# Altium schematic sheet 学习型红外转发器.SchDoc: 学习型红外转发器
size A4; Organization: 智能实训室产品部; Address1: 广东省深圳市; Address2: 宝安区石岩凯普达工业园; DocumentNumber: 190405; Revision: V1.0; SheetNumber: 1; SheetTotal: 2; Date: 2019-04-09; ApprovedBy: 杨青; CheckedBy: 杨青; DrawnBy: 杨青; Engineer: 李剑平; ProjectName_GTA: 江工物联网; PCB Number: GS-X-GXM01
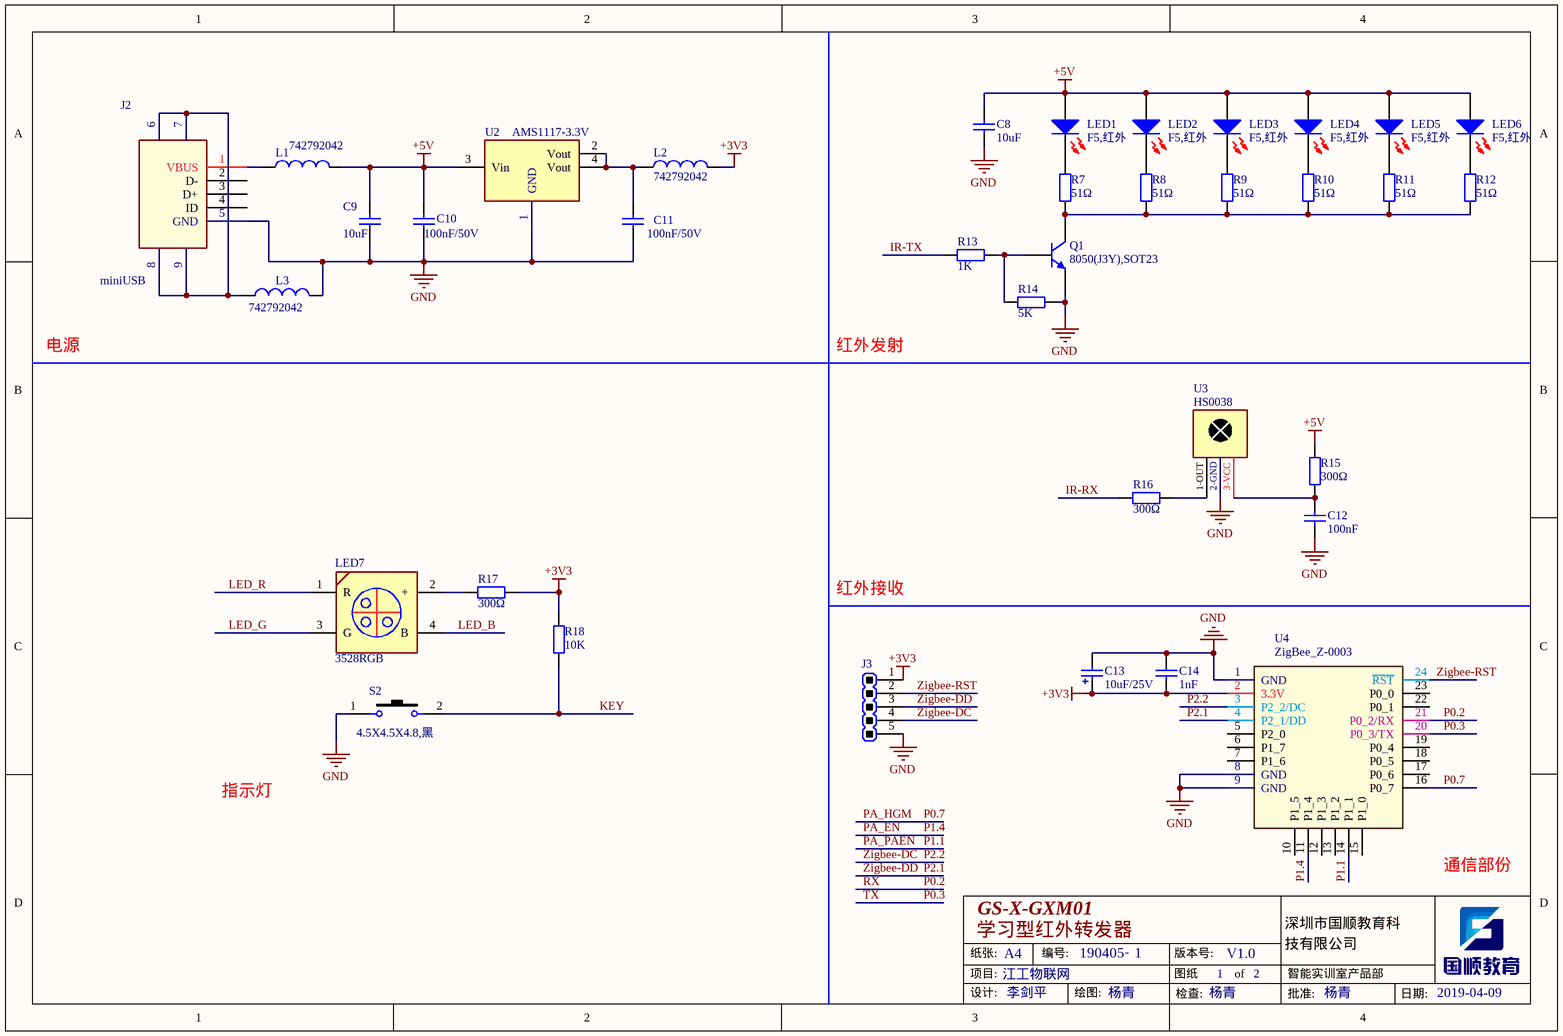
[diagram p0: 学习型红外转发器.SchDoc]

## Parts
C8  10uF  [C0603]
C9  10uF  [C0603]
C10  100nF/50V  [C0603]
C11  100nF/50V  [C0603]
C12  100nF  [C0603]
C13  10uF/25V  [TC3528X21B]
C14  1nF  [C0603]
J2  miniUSB  [USB mini/SM0.8-6H5]
J3  HDRM-1*5-2.54-AK  [HDRM-2.54-1*5P-AK1]  (value not drawn)  (no BOM)
L1  742792042  [L0805]
L2  742792042  [L0805]
L3  742792042  [L0805]
LED1  F5,红外  [IR-F5-V]
LED2  F5,红外  [IR-F5-V]
LED3  F5,红外  [IR-F5-V]
LED4  F5,红外  [IR-F5-V]
LED5  F5,红外  [IR-F5-V]
LED6  F5,红外  [IR-F5-V]
LED7  3528RGB  [LED_3528RGB]
Q1  8050(J3Y),SOT23  [SOT23]
R7  51Ω  [R0603]
R8  51Ω  [R0603]
R9  51Ω  [R0603]
R10  51Ω  [R0603]
R11  51Ω  [R0603]
R12  51Ω  [R0603]
R13  1K  [R0603]
R14  5K  [R0603]
R15  300Ω  [R0603]
R16  300Ω  [R0603]
R17  300Ω  [R0603]
R18  10K  [R0603]
S2  4.5X4.5X4.8,黑  [SW2-4.5*4.5*4.8MM-Side-BK]
U2  AMS1117-3.3V  [SOT-223]
U3  HS0038  [HS0038-H]
U4  ZigBee_Z-0003  [Module_ZigBee_Z-0003]

## Nets
+3V3: C13.1 C14.1 J3.1 L2.2 R17.1 R18.1 U4.2(3.3V)
+5V: C8.1 C9.1 C10.1 L1.2 LED1.1(A) LED2.1(A) LED3.1(A) LED4.1(A) LED5.1(A) LED6.1(A) R15.2 U2.3(Vin)
GND: C8.2 C9.2 C10.2 C11.2 C12.2 C13.2 C14.2 J2.5(GND) J3.5 L3.2 Q1.2(E) R14.2 S2.1 U2.1(GND) U3.2(GND) U4.1(GND) U4.8(GND) U4.9(GND)
IR-RX: R16.1
IR-TX: R13.1
KEY: R18.2 S2.2
LED_B: LED7.4(B)
LED_G: LED7.3(G)
LED_R: LED7.1(R)
P0.2: U4.21(P0_2/RX)  [also labelled RX]
P0.3: U4.20(P0_3/TX)  [also labelled TX]
P0.7: U4.16(P0_7)  [also labelled PA_HGM]
P1.1: U4.14(P1_1)  [also labelled PA_PAEN]
P1.4: U4.11(P1_4)  [also labelled PA_EN]
P2.1: J3.3 U4.4(P2_1/DD)  [also labelled Zigbee-DD]
P2.2: J3.4 U4.3(P2_2/DC)  [also labelled Zigbee-DC]
Zigbee-RST: J3.2 U4.24(~{RST})
NetC11_1: C11.1 L2.1 U2.2(Vout) U2.4(Vout)
NetC12_1: C12.1 R15.1 U3.3(VCC)
NetJ2_1: J2.1(VBUS) L1.1
NetJ2_6: J2.6 J2.7 J2.8 J2.9 L3.1
NetLED1_2: LED1.2(K) R7.2
NetLED2_2: LED2.2(K) R8.2
NetLED3_2: LED3.2(K) R9.2
NetLED4_2: LED4.2(K) R10.2
NetLED5_2: LED5.2(K) R11.2
NetLED6_2: LED6.2(K) R12.2
NetLED7_2: LED7.2(+) R17.2
NetQ1_1: Q1.1(B) R13.2 R14.1
NetQ1_3: Q1.3(C) R7.1 R8.1 R9.1 R10.1 R11.1 R12.1
NetR16_2: R16.2 U3.1(out)

Not connected (* = marked no-connect by the designer): J2 2(D-) 3(D+) 4(ID); U4 5(P2_0) 6(P1_7) 7(P1_6) 10(P1_5) 12(P1_3) 13(P1_2) 15(P1_0) 17(P0_6) 18(P0_5) 19(P0_4) 22(P0_1) 23(P0_0)

## Notes on the sheet
- 电源
- 红外发射
- 红外接收
- 指示灯
- (near U4) 通信部份
- 纸张:
- 项目:
- A4
- 编号:
- -
- 版本号:
- 图纸
- of
- 深圳市国顺教育科
- 技有限公司
- 设计:
- 绘图:
- 检查:
- 批准:
- 日期:
- (in symbol HS0038) 1-OUT; 2-GND; 3-VCC

## Library data of the parts
C8 C9 = 10uF_16V_0603: Capacitor; 编码: 无; 规格/型号: 10uF,16V,0603; 物料名称: 贴片电容
C10-C12 = 100nF_50V_0603: Capacitor; 编码: 无; 规格/型号: 100nF,50V,0603; 物料名称: 贴片电容
C13 = CAPC-10uF/25V_3528B: 钽电容,10uF/25V-3528B; 编码: 1010202012; 物料名称: 贴片钽电容; 规格/型号: 钽电容,10uF,25V,3528,B型
C14 = 1nF_50V_0603: Capacitor; 编码: 无; 规格/型号: 1nF,50V,0603; 物料名称: 贴片电容
J2 = USB-mini-5PF: mini-USB 5PF USB 母座; 规格/型号: mini-USB 5PF,贴片T型,USB 母座,USB-5002; 物料名称: USB接口; 单价: 0.1; 供应商: https://item.taobao.com/item.htm?id=42475441054&ali_refid=a3_420434_1006:1104662507:N:usb+mini:d1ba3785cc0cd36a97b12c38263ecbb3&ali_trackid=1_d1ba3785cc0cd36a97b12c38263ecbb3&spm=a230r.1.1957635.13
J3 = HDRM-1*5-2.54-AK: 排针,直; 规格/型号: 排针,间距2.54,1*5P,180°直插; 物料名称: 排针
L1-L3 = BEAD-742792042_0805: WE-CBF,600@100M,500Ohm,200mA,0805,742792042; 品牌: WE; 物料名称: 贴片磁珠; 规格/型号: WE-CBF,磁珠,600@100M，500Ohm,200mA,0805,742792042; 单价: 0.04
LED1-LED6 = LED-IR_F5: 红外发射; 规格/型号: F5,圆头,红外发射; 物料名称: 直插二极管
LED7 = RGB_3528: 3528,LED RGB; 规格/型号: 3528贴片LED红蓝绿三色七彩雾状灯珠,20mA; 物料名称: 贴片发光二极管; 单价: 0.125; 参数: R:2.0-2.2  G:3.0-3.2 B:3.0-3.2; 供应商: https://detail.tmall.com/item.htm?id=569373898165&ali_refid=a3_430583_1006:1110290364:N:LED%20RGB%203528:b82c81972ee6bbf0f7d8655d7a2e02d6&ali_trackid=1_b82c81972ee6bbf0f7d8655d7a2e02d6&spm=a230r.1.14.1
Q1 = NPN_8050(J3Y)_SOT23: NPN,8050,SOT23; 编码: 1010401001; 规格/型号: NPN,8050,标字J3Y,SOT23; 物料名称: 贴片三极管
R7-R12 = 51Ω_5%_0603: 51Ω,±5%,0603; 物料名称: 贴片电阻; 单价: 0.02; 规格/型号: 51Ω,±5%,0603; 参数: ±5%
R13 = 1K_5%_0603: 1K,±5%,0603; 编码: 1010101190; 物料名称: 贴片电阻; 单价: 0.02; 规格/型号: 1K,±5%,0603
R14 = 5K_5%_0603: 5K,±5%,0603; 物料名称: 贴片电阻; 单价: 0.02; 规格/型号: 5K,±5%,0603
R15-R17 = 300Ω_5%_0603: 300Ω,±5%,0603; 物料名称: 贴片电阻; 单价: 0.02; 规格/型号: 300Ω,±5%,0603
  R15 R16: 参数: ±5%
R18 = 10K_5%_0603: 10K,±5%,0603; 物料名称: 贴片电阻; 单价: 0.02; 规格/型号: 10K,±5%,0603
S2 = SW-PB_4.5X4.5X4.8-3P-SIDE-BK: 4.5X4.5X4.8,侧按3P,黑; 编码: 无; 物料名称: 贴片式轻触开关; 单价: 0.25; 供应商: https://detail.tmall.com/item.htm?spm=a230r.1.14.13.2b5b6ed7J7ZdZk&id=521248158918&cm_id=140105335569ed55e27b&abbucket=13; 规格/型号: 4.5X4.5X4.8,侧按3P,黑
U2 = AMS1117-3.3V_SOT223: 三端稳压器; 编码: 1010402018; 规格/型号: AMS1117-3.3,SOT-223; 物料名称: 贴片稳压芯片; 单价: 0.18
U3 = HS0038: 一体红外接收头; 编码: 1012001008; 规格/型号: HS0038,一体红外接收头,小圆头,2.5MM,黑色,3脚; 供应商: https://item.taobao.com/item.htm?spm=a1z09.2.0.0.2a4e7746xLRNWW&id=522575401769&_u=p65bp1a427f; 物料名称: 一体红外接收头
U4 = Module_ZigBee_Z-0003: zigbee模块; 品牌: 蜂汇; 规格/型号: ZigBee模块,TI CC2530F256,PCB天线,邮票板; 单价: 28; 供应商: https://item.taobao.com/item.htm?spm=a1z09.2.0.0.59a32e8dJHoI4V&id=20029637731&_u=c1sequth8fa8; 物料名称: zigbee模块